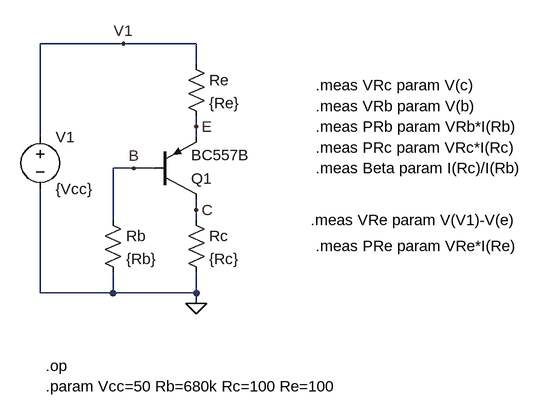
[diagram p0: schematic TBJ02a.asc]
TBJ02a.asc, the LTspice schematic file:
Version 4
SHEET 1 984 680
WIRE 256 -32 128 -32
WIRE 368 -32 256 -32
WIRE 368 0 368 -32
WIRE 368 96 368 80
WIRE 128 112 128 -32
WIRE 368 112 368 96
WIRE 272 160 240 160
WIRE 304 160 272 160
WIRE 368 224 368 208
WIRE 240 240 240 160
WIRE 368 240 368 224
WIRE 128 352 128 192
WIRE 240 352 240 320
WIRE 240 352 128 352
WIRE 368 352 368 320
WIRE 368 352 240 352
WIRE 368 368 368 352
FLAG 368 368 0
FLAG 256 -32 V1
FLAG 368 96 E
FLAG 368 224 C
FLAG 272 160 B
SYMBOL voltage 128 96 R0
WINDOW 123 0 0 Left 0
WINDOW 39 0 0 Left 0
SYMATTR InstName V1
SYMATTR Value {Vcc}
SYMBOL res 224 224 R0
SYMATTR InstName Rb
SYMATTR Value {Rb}
SYMBOL res 352 224 R0
SYMATTR InstName Rc
SYMATTR Value {Rc}
SYMBOL res 352 -16 R0
SYMATTR InstName Re
SYMATTR Value {Re}
SYMBOL pnp 304 208 M180
SYMATTR InstName Q1
SYMATTR Value BC557B
TEXT 136 464 Left 2 !.op
TEXT 136 496 Left 2 !.param Vcc=50 Rb=680k Rc=100 Re=100
TEXT 552 32 Left 2 !.meas VRc param V(c)
TEXT 552 64 Left 2 !.meas VRb param V(b)
TEXT 552 96 Left 2 !.meas PRb param VRb*I(Rb)
TEXT 552 128 Left 2 !.meas PRc param VRc*I(Rc)
TEXT 552 160 Left 2 !.meas Beta param I(Rc)/I(Rb)
TEXT 544 240 Left 2 !.meas VRe param V(V1)-V(e)
TEXT 552 280 Left 2 !.meas PRe param VRe*I(Re)

The netlist it stands for:
* TBJ02a.asc
V1 V1 0 {Vcc}
Rb B 0 {Rb}
Rc C 0 {Rc}
Re V1 E {Re}
Q1 C B E 0 BC557B
.model NPN NPN
.model PNP PNP
.lib standard.bjt
.op
.param Vcc=50 Rb=680k Rc=100 Re=100
.meas VRc param V(c)
.meas VRb param V(b)
.meas PRb param VRb*I(Rb)
.meas PRc param VRc*I(Rc)
.meas Beta param I(Rc)/I(Rb)
.meas VRe param V(V1)-V(e)
.meas PRe param VRe*I(Re)
.backanno
.end